# Altium schematic sheet MCU.SchDoc
size A4
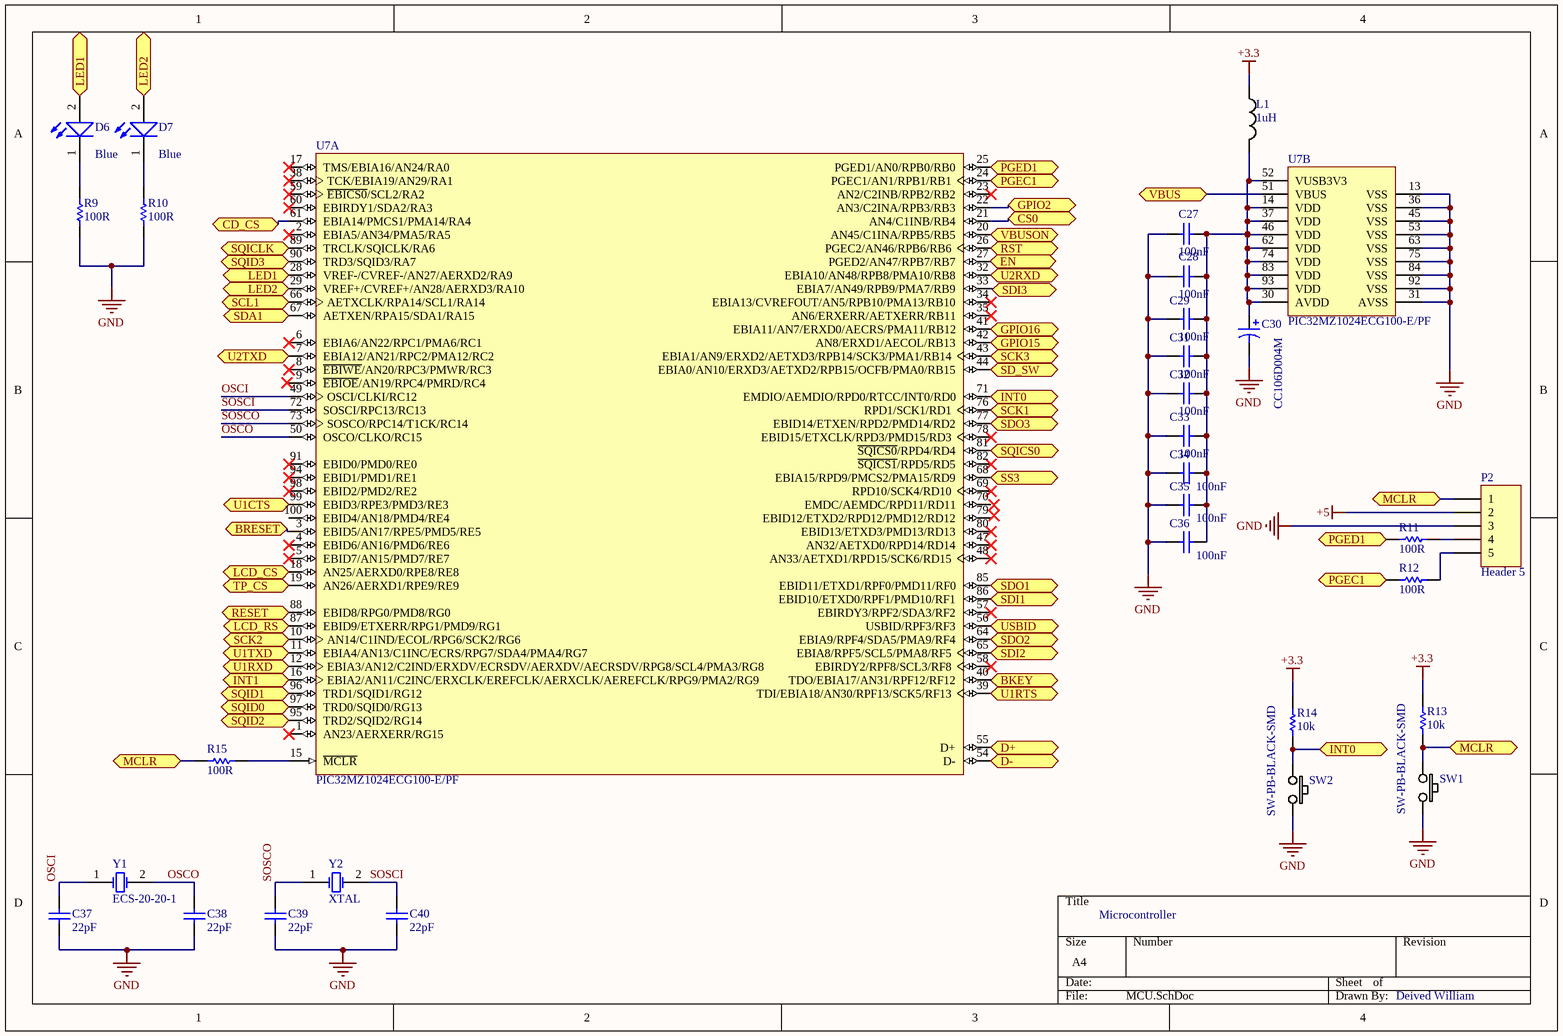
[diagram p0: MCU.SchDoc]

## Parts
C27  value 100nF  [WCAP-CSGP_0603, 1.6x0.8x0.8mm_Reflow]  (hidden comment: 885012206020)
C28  value 100nF  [WCAP-CSGP_0603, 1.6x0.8x0.8mm_Reflow]  (hidden comment: 885012206020)
C29  value 100nF  [WCAP-CSGP_0603, 1.6x0.8x0.8mm_Reflow]  (hidden comment: 885012206020)
C30  CC106D004M  [D]
C31  value 100nF  [WCAP-CSGP_0603, 1.6x0.8x0.8mm_Reflow]  (hidden comment: 885012206020)
C32  value 100nF  [WCAP-CSGP_0603, 1.6x0.8x0.8mm_Reflow]  (hidden comment: 885012206020)
C33  value 100nF  [WCAP-CSGP_0603, 1.6x0.8x0.8mm_Reflow]  (hidden comment: 885012206020)
C34  value 100nF  [WCAP-CSGP_0603, 1.6x0.8x0.8mm_Reflow]  (hidden comment: 885012206020)
C35  value 100nF  [WCAP-CSGP_0603, 1.6x0.8x0.8mm_Reflow]  (hidden comment: 885012206020)
C36  value 100nF  [WCAP-CSGP_0603, 1.6x0.8x0.8mm_Reflow]  (hidden comment: 885012206020)
C37  value 22pF  [WCAP-CSGP_0603, 1.6x0.8x0.8mm_Reflow]  (hidden comment: 885012006004)
C38  value 22pF  [WCAP-CSGP_0603, 1.6x0.8x0.8mm_Reflow]  (hidden comment: 885012006004)
C39  value 22pF  [WCAP-CSGP_0603, 1.6x0.8x0.8mm_Reflow]  (hidden comment: 885012006004)
C40  value 22pF  [WCAP-CSGP_0603, 1.6x0.8x0.8mm_Reflow]  (hidden comment: 885012006004)
D6  Emitting Color: Blue  [WL-SMCW_0805]  (hidden comment: 150080BS75000)
D7  Emitting Color: Blue  [WL-SMCW_0805]  (hidden comment: 150080BS75000)
L1  1uH  [TAIYO-NLS5012-GENERIC]
P2  Header 5  [HDR1X5]
R9  100R  [3-0603]
R10  100R  [3-0603]
R11  100R  [3-0603]
R12  100R  [3-0603]
R13  10k  [3-0603]
R14  10k  [3-0603]
R15  100R  [3-0603]
SW1  SW-PB-BLACK-SMD  [SW-PB-SMD]
SW2  SW-PB-BLACK-SMD  [SW-PB-SMD]
U7  PIC32MZ1024ECG100-E/PF  [MCHP-TQFP-PF100_N]  (parts A,B of 2)
Y1  ECS-20-20-1  [HC-49U]
Y2  XTAL  [R38]

## Ports
BKEY, BRESET, CD_CS, CS0, D+, D-, EN, GPIO2, GPIO15, GPIO16, INT0, INT1, LCD_CS, LCD_RS, LED1, LED2, MCLR, PGEC1, PGED1, RESET, RST, SCK1, SCK2, SCK3, SCL1, SD_SW, SDA1, SDI1, SDI2, SDI3, SDO1, SDO2, SDO3, SQICLK, SQICS0, SQID0, SQID1, SQID2, SQID3, SS3, TP_CS, U1CTS, U1RTS, U1RXD, U1TXD, U2RXD, U2TXD, USBID, VBUS, VBUSON

## Nets
+3.3: L1.1 R13.2 R14.2
+5: P2.2
GND: C27.2 C28.2 C29.2 C30.2 C31.2 C32.2 C33.2 C34.2 C35.2 C36.2 C37.1 C38.1 C39.1 C40.1 P2.3 R9.1 R10.1 SW1.2 SW2.2 U7.13(VSS) U7.31(AVSS) U7.36(VSS) U7.45(VSS) U7.53(VSS) U7.63(VSS) U7.75(VSS) U7.84(VSS) U7.92(VSS)
BKEY: U7.40(TDO/EBIA17/AN31/RPF12/RF12) ; port BKEY
BRESET: U7.3(EBID5/AN17/RPE5/PMD5/RE5) ; port BRESET
CD_CS: U7.61(EBIA14/PMCS1/PMA14/RA4) ; port CD_CS
CS0: U7.21(AN4/C1INB/RB4) ; port CS0
D+: U7.55(D+) ; port D+
D-: U7.54(D-) ; port D-
EN: U7.27(PGED2/AN47/RPB7/RB7) ; port EN
GPIO2: U7.22(AN3/C2INA/RPB3/RB3) ; port GPIO2
GPIO15: U7.42(AN8/ERXD1/AECOL/RB13) ; port GPIO15
GPIO16: U7.41(EBIA11/AN7/ERXD0/AECRS/PMA11/RB12) ; port GPIO16
INT0: R14.1 SW2.1 U7.71(EMDIO/AEMDIO/RPD0/RTCC/INT0/RD0) ; port INT0
INT1: U7.16(EBIA2/AN11/C2INC/ERXCLK/EREFCLK/AERXCLK/AEREFCLK/RPG9/PMA2/RG9) ; port INT1
LCD_CS: U7.18(AN25/AERXD0/RPE8/RE8) ; port LCD_CS
LCD_RS: U7.87(EBID9/ETXERR/RPG1/PMD9/RG1) ; port LCD_RS
LED1: D6.2(A) U7.28(VREF-/CVREF-/AN27/AERXD2/RA9) ; port LED1
LED2: D7.2(A) U7.29(VREF+/CVREF+/AN28/AERXD3/RA10) ; port LED2
MCLR: P2.1 R13.1 R15.1 SW1.1 ; port MCLR
OSCI: C37.2 U7.49(OSCI/CLKI/RC12) Y1.1(OSC1)
OSCO: C38.2 U7.50(OSCO/CLKO/RC15) Y1.2(OSC2)
PGEC1: R12.1 U7.24(PGEC1/AN1/RPB1/RB1) ; port PGEC1
PGED1: R11.1 U7.25(PGED1/AN0/RPB0/RB0) ; port PGED1
RESET: U7.88(EBID8/RPG0/PMD8/RG0) ; port RESET
RST: U7.26(PGEC2/AN46/RPB6/RB6) ; port RST
SCK1: U7.76(RPD1/SCK1/RD1) ; port SCK1
SCK2: U7.10(AN14/C1IND/ECOL/RPG6/SCK2/RG6) ; port SCK2
SCK3: U7.43(EBIA1/AN9/ERXD2/AETXD3/RPB14/SCK3/PMA1/RB14) ; port SCK3
SCL1: U7.66(AETXCLK/RPA14/SCL1/RA14) ; port SCL1
SD_SW: U7.44(EBIA0/AN10/ERXD3/AETXD2/RPB15/OCFB/PMA0/RB15) ; port SD_SW
SDA1: U7.67(AETXEN/RPA15/SDA1/RA15) ; port SDA1
SDI1: U7.86(EBID10/ETXD0/RPF1/PMD10/RF1) ; port SDI1
SDI2: U7.65(EBIA8/RPF5/SCL5/PMA8/RF5) ; port SDI2
SDI3: U7.33(EBIA7/AN49/RPB9/PMA7/RB9) ; port SDI3
SDO1: U7.85(EBID11/ETXD1/RPF0/PMD11/RF0) ; port SDO1
SDO2: U7.64(EBIA9/RPF4/SDA5/PMA9/RF4) ; port SDO2
SDO3: U7.77(EBID14/ETXEN/RPD2/PMD14/RD2) ; port SDO3
SOSCI: C40.2 U7.72(SOSCI/RPC13/RC13) Y2.2(OSC2)
SOSCO: C39.2 U7.73(SOSCO/RPC14/T1CK/RC14) Y2.1(OSC1)
SQICLK: U7.89(TRCLK/SQICLK/RA6) ; port SQICLK
SQICS0: U7.81(~{SQICS0}/RPD4/RD4) ; port SQICS0
SQID0: U7.97(TRD0/SQID0/RG13) ; port SQID0
SQID1: U7.96(TRD1/SQID1/RG12) ; port SQID1
SQID2: U7.95(TRD2/SQID2/RG14) ; port SQID2
SQID3: U7.90(TRD3/SQID3/RA7) ; port SQID3
SS3: U7.68(EBIA15/RPD9/PMCS2/PMA15/RD9) ; port SS3
TP_CS: U7.19(AN26/AERXD1/RPE9/RE9) ; port TP_CS
U1CTS: U7.99(EBID3/RPE3/PMD3/RE3) ; port U1CTS
U1RTS: U7.39(TDI/EBIA18/AN30/RPF13/SCK5/RF13) ; port U1RTS
U1RXD: U7.12(EBIA3/AN12/C2IND/ERXDV/ECRSDV/AERXDV/AECRSDV/RPG8/SCL4/PMA3/RG8) ; port U1RXD
U1TXD: U7.11(EBIA4/AN13/C1INC/ECRS/RPG7/SDA4/PMA4/RG7) ; port U1TXD
U2RXD: U7.32(EBIA10/AN48/RPB8/PMA10/RB8) ; port U2RXD
U2TXD: U7.7(EBIA12/AN21/RPC2/PMA12/RC2) ; port U2TXD
USBID: U7.56(USBID/RPF3/RF3) ; port USBID
VBUS: U7.51(VBUS) ; port VBUS
VBUSON: U7.20(AN45/C1INA/RPB5/RB5) ; port VBUSON
NetC27_1: C27.1 C28.1 C29.1 C30.1 C31.1 C32.1 C33.1 C34.1 C35.1 C36.1 L1.2 U7.14(VDD) U7.30(AVDD) U7.37(VDD) U7.46(VDD) U7.52(VUSB3V3) U7.62(VDD) U7.74(VDD) U7.83(VDD) U7.93(VDD)
NetD6_1: D6.1(K) R9.2
NetD7_1: D7.1(K) R10.2
NetP2_4: P2.4 R11.2
NetP2_5: P2.5 R12.2
NetR15_2: R15.2 U7.15(~{MCLR})

Not connected (* = marked no-connect by the designer): U7 1(AN23/AERXERR/RG15)* 2(EBIA5/AN34/PMA5/RA5)* 4(EBID6/AN16/PMD6/RE6)* 5(EBID7/AN15/PMD7/RE7)* 6(EBIA6/AN22/RPC1/PMA6/RC1)* 8(~{EBIWE}/AN20/RPC3/PMWR/RC3)* 9(~{EBIOE}/AN19/RPC4/PMRD/RC4) 17(TMS/EBIA16/AN24/RA0)* 23(AN2/C2INB/RPB2/RB2)* 34(EBIA13/CVREFOUT/AN5/RPB10/PMA13/RB10)* 35(AN6/ERXERR/AETXERR/RB11)* 38(TCK/EBIA19/AN29/RA1)* 47(AN32/AETXD0/RPD14/RD14)* 48(AN33/AETXD1/RPD15/SCK6/RD15)* 57(EBIRDY3/RPF2/SDA3/RF2)* 58(EBIRDY2/RPF8/SCL3/RF8)* 59(~{EBICS0}/SCL2/RA2)* 60(EBIRDY1/SDA2/RA3)* 69(RPD10/SCK4/RD10)* 70(EMDC/AEMDC/RPD11/RD11) 78(EBID15/ETXCLK/RPD3/PMD15/RD3)* 79(EBID12/ETXD2/RPD12/PMD12/RD12) 80(EBID13/ETXD3/PMD13/RD13)* 82(~{SQICS1}/RPD5/RD5)* 91(EBID0/PMD0/RE0)* 94(EBID1/PMD1/RE1)* 98(EBID2/PMD2/RE2)* 100(EBID4/AN18/PMD4/RE4)

## Notes on the sheet
- Microcontroller
- Deived William

## Library data of the parts
C27-C29 C31-C36 = 885012206020: WCAP-CSGP Ceramic Capacitors, size 0603, 1.6x0.8x0.8mm, 10V, X7R, 100nF; Rated Voltage: 10V DC; ComponentLink1Description: Manufacturer; ComponentLink1URL: http://www.we-online.de; ComponentLink2Description: Datasheet; ComponentLink2URL: http://katalog.we-online.de/pbs/datasheet/885012206020.pdf; Part Number: 885012206020; Published Date: June 2017; Publisher: Wurth Elektronik; Size: 0603, 1.6x0.8x0.8mm; Ceramic Type: X7R
C30 = CC106D004M: Conformal Coated Solid Tantalum Chip Capacitor: Standard Range, 10uF, 20% Tolerance, 4 WVDC @ -55°C to +85°C, Surge = 5V; Note: See Data Sheet for full range of components; Published: 19-Mar-2004; DatasheetDocument: 21-Mar-2002; PackageReference: D; Publisher: Altium Limited; ComponentLink1Description: Manufacturer Link; ComponentLink1URL: http://www.vishay.com/; ComponentLink2Description: Datasheet; ComponentLink2URL: http://www.vishay.com/docs/43017/ccec.pdf; Value: 10uF
C37-C40 = 885012006004: WCAP-CSGP Ceramic Capacitors, size 0603, 1.6x0.8x0.8mm, 10V, NP0, 22pF; Rated Voltage: 10V DC; ComponentLink1Description: Manufacturer; ComponentLink1URL: http://www.we-online.de; ComponentLink2Description: Datasheet; ComponentLink2URL: http://katalog.we-online.de/pbs/datasheet/885012006004.pdf; Part Number: 885012006004; Published Date: June 2017; Publisher: Wurth Elektronik; Size: 0603, 1.6x0.8x0.8mm; Ceramic Type: NP0
D6 D7 = 150080BS75000: WL-SMCW SMD Mono-color Chip LED Waterclear, size 0805, Blue; Forward Voltage: 3.2 V; Viewing Angle: 140°; Peak Wavelength: 465 nm; Published Date: Jan 2017; Publisher: Wurth Elektronik; ComponentLink1Description: Manufacturer; ComponentLink1URL: http://www.we-online.de; ComponentLink2Description: Datasheet; ComponentLink2URL: http://katalog.we-online.de/led/datasheet/150080BS75000.pdf; Part Number: 150080BS75000; Size: 0805
L1 = 1U-NRS5012-TAIYO: 1U-NRS5012
P2 = Header 5: Header, 5-Pin; LatestRevisionDate: 17-Jul-2002; LatestRevisionNote: Re-released for DXP Platform.; Publisher: Altium Limited
R9-R15 = ERJ3RE: Precision Thick Film Chip Resistor, 10 Ohm to 1M Ohm Range, 1% and 0.5% Tolerance, 0603 Size, 0.063 W; Published: 17-Dec-2003; LatestRevisionDate: 19-Mar-2004; LatestRevisionNote: Silkscreen size reduced.; PackageDocument: Mar-2003; PackageReference: 3-0603; Publisher: Altium Limited; Code_IPC: 1608 [0603]; ComponentLink1Description: Manufacturer Link; ComponentLink1URL: http://www.panasonic.com/industrial/components/resistive_products.htm; ComponentLink2Description: Datasheet; ComponentLink2URL: http://www.panasonic.com/industrial/components/pdf/AOA0000CE2.pdf
SW1 SW2 = SW-PB-BLACK-SMD: PUSHBUTTON SWITCH 6MM SMD
U7 = PIC32MZ1024ECG100-E/PF: 32-Bit Microcontroller with Audio and Graphics Interfaces, HS USB, Ethernet, and Advanced Analog, 1024 KB Program Memory, 78 I/O Pins, PMP, Extended Temperature, 100-Pin TQFP (PF100), Tray; Manufacturer: Microchip; VCC Range: 2.2 to 3.6 V; DatasheetVersion: Rev. B; PackageVersion: C04-110B, 12/2012; PackageReference: TQFP-PF100; PackageDescription: 100-Lead Thin Plastic Quad Flat Pack, 14 x 14 mm Body, 0.5 mm Pitch; Supplier 1: Newark; Supplier Part Number 1: 17X9269; Supplier 2: Mouser; Supplier Part Number 2: 579-1024ECG100-E/PF; Packing: Tray; Mounting Technology: Surface Mount; PartNumber: PIC32MZ1024ECG100-E/PF; ComponentLink1Description: Manufacturer URL; ComponentLink1URL: http://www.microchip.com/; ComponentLink2Description: Datasheet; ComponentLink2URL: http://ww1.microchip.com/downloads/en/DeviceDoc/60001191B.pdf; ComponentLink3Description: Package Specification; ComponentLink3URL: http://www.microchip.com/stellent/groups/techpub_sg/documents/packagingspec/en012702.pdf
Y1 = ECS-20-20-1: Crystal Oscillator; Published: 17-Jul-2002; DatasheetDocument: 18-Apr-2000; PackageReference: HC-49U; Publisher: Altium Limited; ComponentLink1Description: Manufacturer Link; ComponentLink1URL: http://www.ecsxtal.com/; ComponentLink2Description: Datasheet; ComponentLink2URL: http://www.ecsxtal.com/pdf2/HC49U.PDF
Y2 = XTAL: Crystal Oscillator; Published: 8-Jun-2000; LatestRevisionDate: 17-Jul-2002; LatestRevisionNote: Re-released for DXP Platform.; PackageReference: R38; Publisher: Altium Limited; PackageDescription: Crystal, Thru-Hole; 2 Leads; Body 3.1 x 8.2 mm (Dia.xH)